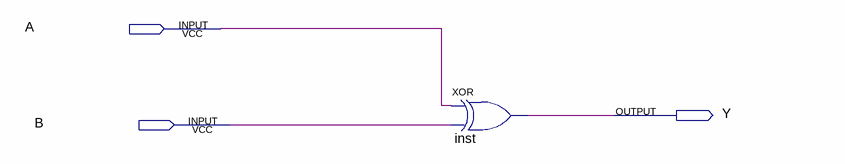
[diagram p0: schematic sheet]
// Quartus schematic test1.bdf as structural Verilog: 1 symbols, 3 pins
module test1 (
  input  A,
  input  B,
  output Y
);

  xor inst (Y, A, B);
endmodule
